# Altium schematic sheet Top.SchDoc
size A; SheetNumber: 1; SheetTotal: 8
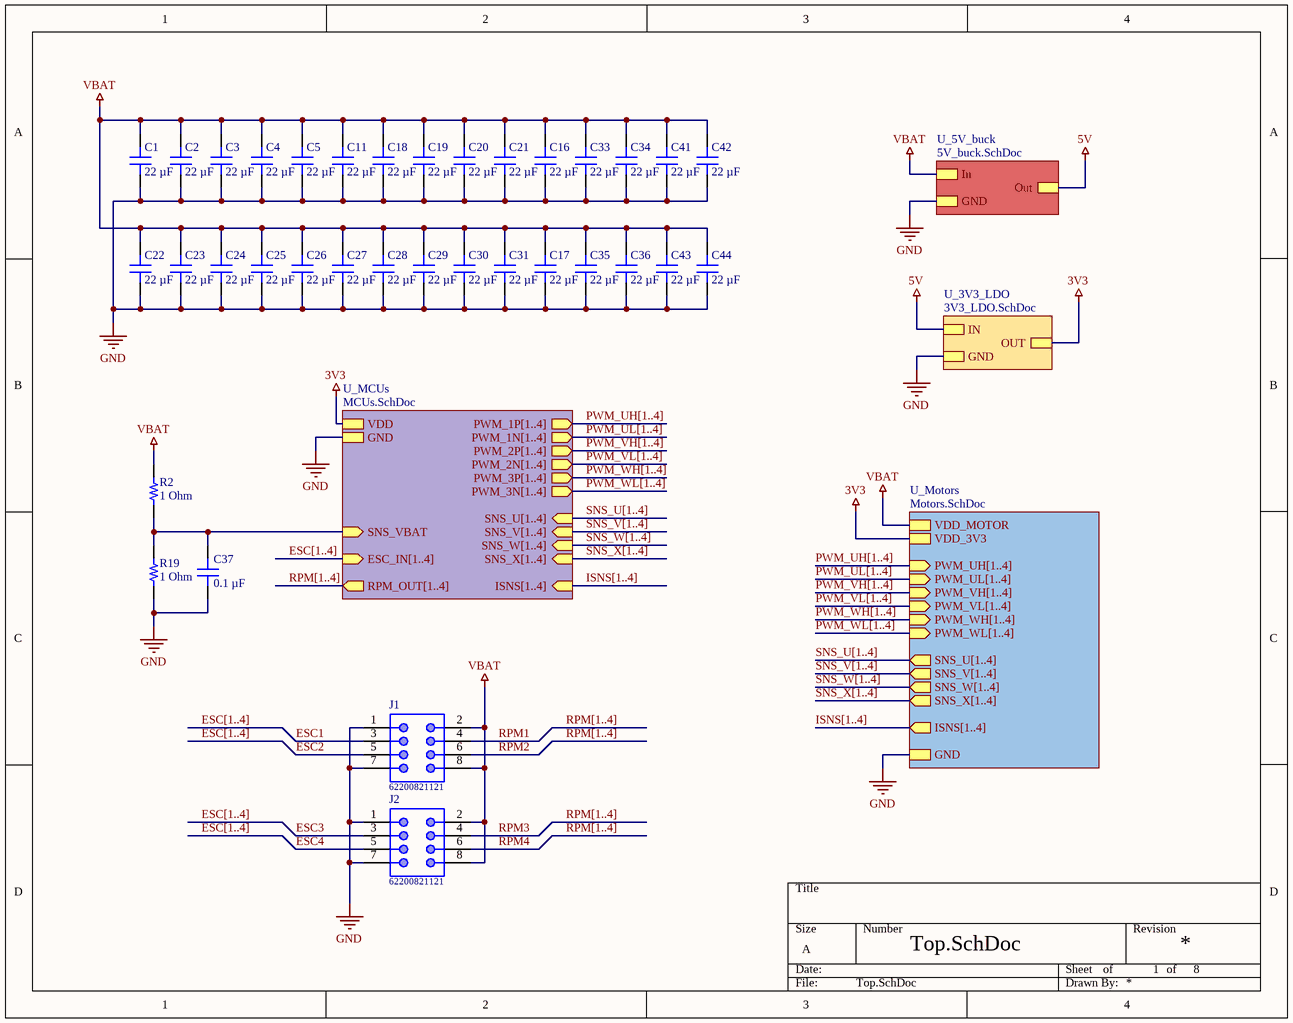
[diagram p0: Top.SchDoc]

## Parts
C1  22 µF  [CAP 0805_2012]
C2  22 µF  [CAP 0805_2012]
C3  22 µF  [CAP 0805_2012]
C4  22 µF  [CAP 0805_2012]
C5  22 µF  [CAP 0805_2012]
C11  22 µF  [CAP 0805_2012]
C16  22 µF  [CAP 0805_2012]
C17  22 µF  [CAP 0805_2012]
C18  22 µF  [CAP 0805_2012]
C19  22 µF  [CAP 0805_2012]
C20  22 µF  [CAP 0805_2012]
C21  22 µF  [CAP 0805_2012]
C22  22 µF  [CAP 0805_2012]
C23  22 µF  [CAP 0805_2012]
C24  22 µF  [CAP 0805_2012]
C25  22 µF  [CAP 0805_2012]
C26  22 µF  [CAP 0805_2012]
C27  22 µF  [CAP 0805_2012]
C28  22 µF  [CAP 0805_2012]
C29  22 µF  [CAP 0805_2012]
C30  22 µF  [CAP 0805_2012]
C31  22 µF  [CAP 0805_2012]
C33  22 µF  [CAP 0805_2012]
C34  22 µF  [CAP 0805_2012]
C35  22 µF  [CAP 0805_2012]
C36  22 µF  [CAP 0805_2012]
C37  0.1 µF  [CAP 0402_1005]
C41  22 µF  [CAP 0805_2012]
C42  22 µF  [CAP 0805_2012]
C43  22 µF  [CAP 0805_2012]
C44  22 µF  [CAP 0805_2012]
J1  62200821121  [62200821121]
J2  62200821121  [62200821121]
R2  1 Ohm  [RES 0402_1005]
R19  1 Ohm  [RES 0402_1005]

## Sub-sheets
U_3V3_LDO = 3V3_LDO.SchDoc: OUT, IN, GND
U_5V_buck = 5V_buck.SchDoc: Out, In, GND
U_MCUs = MCUs.SchDoc: VDD, GND, PWM_1P[1..4] (out), PWM_1N[1..4] (out), PWM_2P[1..4] (out), PWM_2N[1..4] (out), PWM_3P[1..4] (out), PWM_3N[1..4] (out), SNS_U[1..4] (in), SNS_V[1..4] (in), SNS_W[1..4] (in), SNS_X[1..4] (in), ISNS[1..4] (in), ESC_IN[1..4] (in), RPM_OUT[1..4] (out), SNS_VBAT (in)
U_Motors = Motors.SchDoc: VDD_MOTOR, GND, PWM_UH[1..4] (in), PWM_UL[1..4] (in), PWM_VH[1..4] (in), PWM_VL[1..4] (in), PWM_WH[1..4] (in), PWM_WL[1..4] (in), SNS_U[1..4] (out), SNS_V[1..4] (out), SNS_W[1..4] (out), SNS_X[1..4] (out), VDD_3V3, ISNS[1..4] (out)

## Nets
3V3: sheet U_3V3_LDO/OUT, sheet U_Motors/VDD_3V3, sheet U_MCUs/VDD
5V: sheet U_5V_buck/Out, sheet U_3V3_LDO/IN
GND: C1.1 C2.1 C3.1 C4.1 C5.1 C11.1 C16.1 C17.1 C18.1 C19.1 C20.1 C21.1 C22.1 C23.1 C24.1 C25.1 C26.1 C27.1 C28.1 C29.1 C30.1 C31.1 C33.1 C34.1 C35.1 C36.1 C37.1 C41.1 C42.1 C43.1 C44.1 J1.1 J1.7 J2.1 J2.7 R19.1 ; sheet U_5V_buck/GND, sheet U_3V3_LDO/GND, sheet U_Motors/GND, sheet U_MCUs/GND
VBAT: C1.2 C2.2 C3.2 C4.2 C5.2 C11.2 C16.2 C17.2 C18.2 C19.2 C20.2 C21.2 C22.2 C23.2 C24.2 C25.2 C26.2 C27.2 C28.2 C29.2 C30.2 C31.2 C33.2 C34.2 C35.2 C36.2 C41.2 C42.2 C43.2 C44.2 J1.2 J1.8 J2.2 J2.8 R2.2 ; sheet U_5V_buck/In, sheet U_Motors/VDD_MOTOR
ESC1: J1.3
ESC2: J1.5
ESC3: J2.3
ESC4: J2.5
RPM1: J1.4
RPM2: J1.6
RPM3: J2.4
RPM4: J2.6
NetC37_2: C37.2 R2.1 R19.2 ; sheet U_MCUs/SNS_VBAT

## Buses and harness runs
bus ESC[1..4]
bus ESC[1..4] = sheet U_MCUs/ESC_IN[1..4]
bus ISNS[1..4] = sheet U_MCUs/ISNS[1..4]
bus ISNS[1..4] = sheet U_Motors/ISNS[1..4]
bus PWM_UH[1..4] = sheet U_MCUs/PWM_1P[1..4]
bus PWM_UH[1..4] = sheet U_Motors/PWM_UH[1..4]
bus PWM_UL[1..4] = sheet U_MCUs/PWM_1N[1..4]
bus PWM_UL[1..4] = sheet U_Motors/PWM_UL[1..4]
bus PWM_VH[1..4] = sheet U_MCUs/PWM_2P[1..4]
bus PWM_VH[1..4] = sheet U_Motors/PWM_VH[1..4]
bus PWM_VL[1..4] = sheet U_MCUs/PWM_2N[1..4]
bus PWM_VL[1..4] = sheet U_Motors/PWM_VL[1..4]
bus PWM_WH[1..4] = sheet U_MCUs/PWM_3P[1..4]
bus PWM_WH[1..4] = sheet U_Motors/PWM_WH[1..4]
bus PWM_WL[1..4] = sheet U_MCUs/PWM_3N[1..4]
bus PWM_WL[1..4] = sheet U_Motors/PWM_WL[1..4]
bus RPM[1..4]
bus RPM[1..4] = sheet U_MCUs/RPM_OUT[1..4]
bus SNS_U[1..4] = sheet U_MCUs/SNS_U[1..4]
bus SNS_U[1..4] = sheet U_Motors/SNS_U[1..4]
bus SNS_V[1..4] = sheet U_MCUs/SNS_V[1..4]
bus SNS_V[1..4] = sheet U_Motors/SNS_V[1..4]
bus SNS_W[1..4] = sheet U_MCUs/SNS_W[1..4]
bus SNS_W[1..4] = sheet U_Motors/SNS_W[1..4]
bus SNS_X[1..4] = sheet U_MCUs/SNS_X[1..4]
bus SNS_X[1..4] = sheet U_Motors/SNS_X[1..4]

## Notes on the sheet
- of

## Library data of the parts
C1-C5 C11 C16-C31 C33-C36 C41-C44 = CC0805MKX5R8BB226: CAP CER 22UF 25V X5R 0805; manufacturer: Yageo; Tolerance: ±20%; Part Number: CC0805MKX5R8BB226; Value: 22 µF; Applications: General Purpose; Capacitance: 22 µF; componentlink1description: Datasheet; componentlink1url: https://www.yageo.com/upload/media/product/productsearch/datasheet/mlcc/UPY-GPHC_X5R_4V-to-50V_25.pdf; componentlink2description: DigiKey Link; componentlink2url: https://www.digikey.com/en/products/detail/yageo/CC0805MKX5R8BB226/5195309; Device Package: 0805 (2012 Metric); Lifecycle Status: Active; Minimum Order: 1; Mounting Type: Surface Mount, MLCC; Operating Temperature: -55°C ~ 85°C; Package / Case: 0805 (2012 Metric); packaging: TapeAndReel; partid: 39226; Part Status: Active; price: 0.10; series: CC; Size / Dimension: 0.079" L x 0.049" W (2.00mm x 1.25mm); Supplier 1: DigiKey; Supplier Part Number 1: 311-1903-1-ND; Temperature Coefficient: X5R; Thickness (Max): 0.057" (1.45mm); Voltage - Rated: 25V
  C1-C5 C11 C16-C19 C21-C31 C33-C36 C41-C44: lastupdated: 8/21/2022 8:03:23 PM
  C20: lastupdated: 8/25/2022 6:52:09 AM
C37 = C0402C104K4RACAUTO: CAP CER 0.1UF 16V X7R 0402; manufacturer: KEMET; Tolerance: ±10%; Part Number: C0402C104K4RACAUTO; Value: 0.1 µF; Applications: Automotive, Bypass, Decoupling; Capacitance: 0.1 µF; componentlink1description: Datasheet; componentlink1url: https://api.kemet.com/component-edge/download/specsheet/C0402C104K4RACAUTO.pdf; componentlink2description: DigiKey Link; componentlink2url: https://www.digikey.com/en/products/detail/kemet/C0402C104K4RACAUTO/3314827; Device Package: 0402 (1005 Metric); lastupdated: 8/14/2022 9:05:51 PM; Lifecycle Status: Active; Minimum Order: 1; Mounting Type: Surface Mount, MLCC; Operating Temperature: -55°C ~ 125°C; Package / Case: 0402 (1005 Metric); packaging: TapeAndReel; partid: 3024; Part Status: Active; price: 0.01; Ratings: AEC-Q200; series: SMD Auto X7R; Size / Dimension: 0.039" L x 0.020" W (1.00mm x 0.50mm); Supplier 1: DigiKey; Supplier Part Number 1: 399-6828-1-ND; Temperature Coefficient: X7R; Thickness (Max): 0.022" (0.55mm); Voltage - Rated: 16V
J1 J2 = 62200821121: WR-PHD Pin Header, THT, pitch 1.27mm, Dual Row, Vertical, 8p; Manufacturer: Wurth Elektronik; Pin Number: 8; Rated Current: 1A; Working Voltage: 100VAC; Withstanding Voltage: 500VAC; Contact Resistance: 20mOhm; System: Connector; ComponentLink1Description: Manufacturer; ComponentLink1URL: http://www.we-online.de; ComponentLink2Description: Datasheet; ComponentLink2URL: https://www.we-online.com/catalog/datasheet/62200821121.pdf; Manufacturer Part Number: 62200821121; Published Date: May 2020; Pitch: 1.27mm; Operating Temperature: -40 to +105degC; Mounting Technology: THT; Packaging: Box; Gender: Pin Header; Row Number: Dual; Orientation: Vertical
R2 R19 = RK73H1ETTP1432F: RES 14.3K OHM 1% 1/10W 0402; Manufacturer: KOA Speer Electronics, Inc.; Power (Watts): 0.1W, 1/10W; Resistance: 14.3 kOhms; Temperature Coefficient: ±100ppm/°C; Part Number: RK73H1ETTP1432F; Value: 1 Ohm; ComponentLink1Description: Datasheet; ComponentLink1URL: http://www.koaspeer.com/catimages/Products/RK73H/RK73H.pdf; ComponentLink2Description: DigiKey Link; ComponentLink2URL: https://www.digikey.com/en/products/detail/koa-speer-electronics-inc/RK73H1ETTP1432F/9844351; Composition: Thick Film; Device Package: 0402 (1005 Metric); Features: Automotive AEC-Q200, Moisture Resistant; Height - Seated (Max): 0.016" (0.40mm); LastUpdated: 8/14/2022 9:23:49 PM; Lifecycle Status: Active; Minimum Order: 1; Number of Terminations: 2; Operating Temperature: -55°C ~ 155°C; Package / Case: 0402 (1005 Metric); Packaging: CutTape; PartId: 10193; Part Status: Active; Price: 0.01; Ratings: AEC-Q200; Series: RK73H; Size / Dimension: 0.039" L x 0.020" W (1.00mm x 0.50mm); Supplier 1: DigiKey; Supplier Part Number 1: 2019-RK73H1ETTP1432FCT-ND; Supplier Device Package: 0402; Tolerance: ±1%